# Altium schematic sheet TemperatureMon.SchDoc
size 431 x 279 mm; SheetNumber: 7; SheetTotal: 8
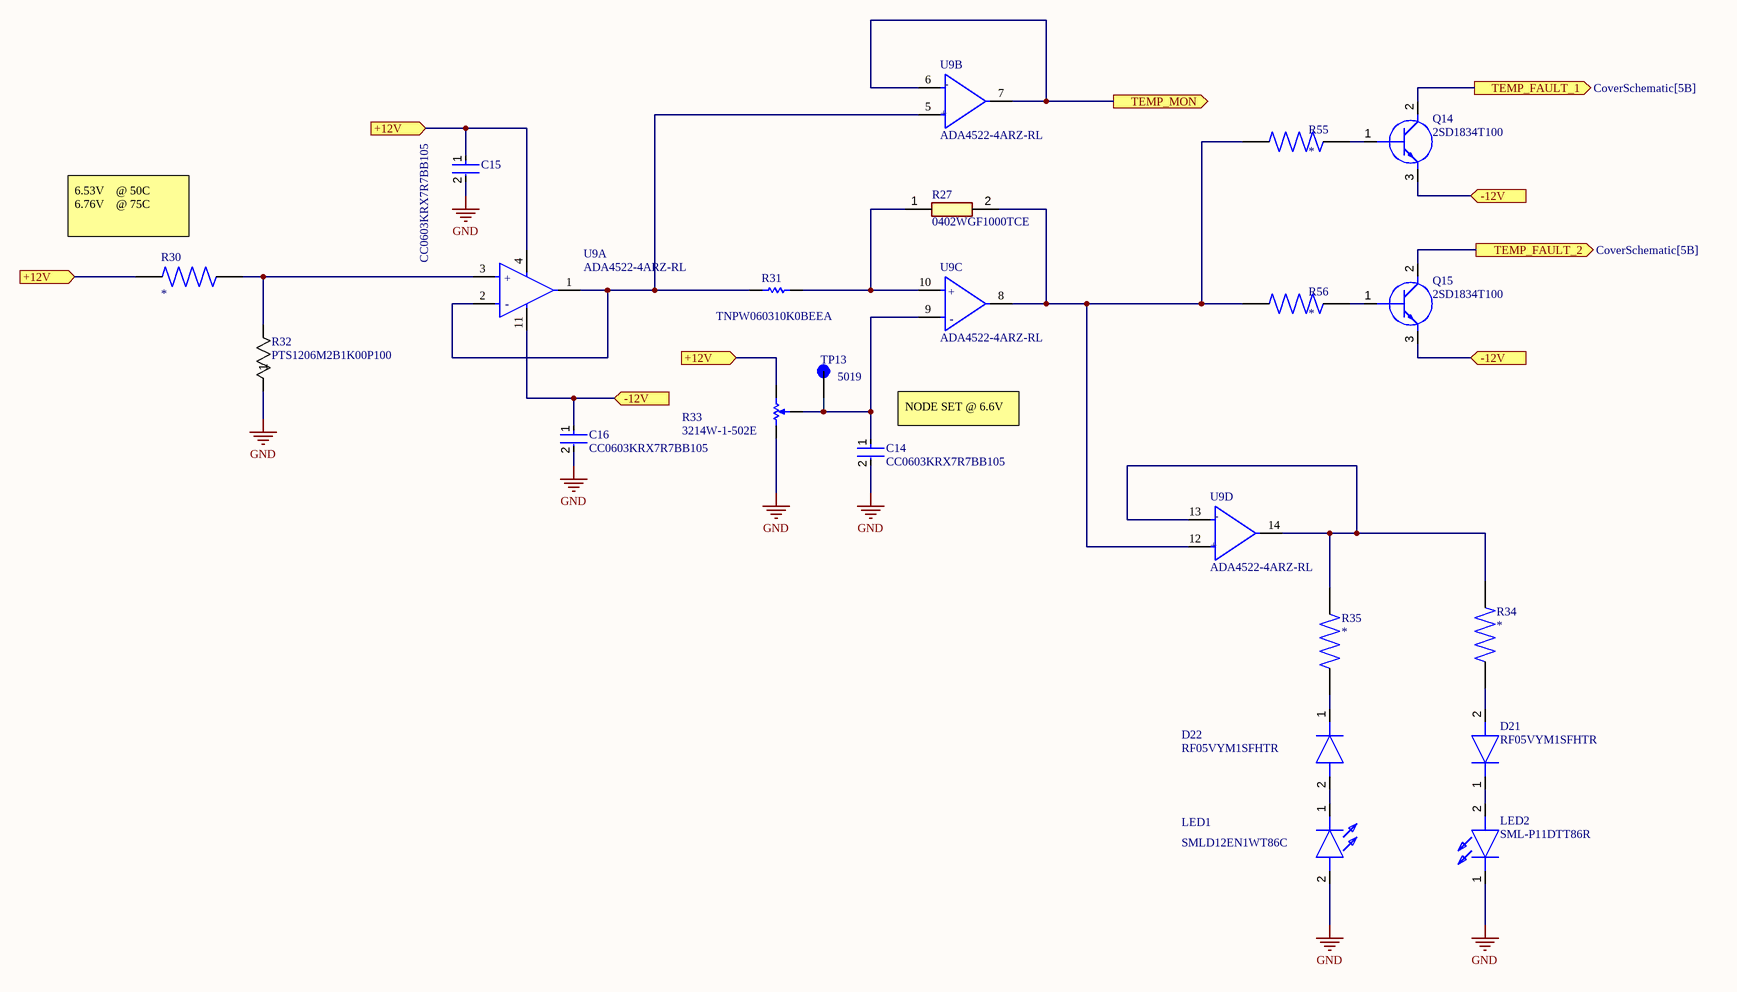
[diagram p0: TemperatureMon.SchDoc]

## Parts
C14  CC0603KRX7R7BB105  [FP-CC0603-DA-MFG]
C15  CC0603KRX7R7BB105  [FP-CC0603-DA-MFG]
C16  CC0603KRX7R7BB105  [FP-CC0603-DA-MFG]
D21  RF05VYM1SFHTR  [RF05VYM1SFHTR]
D22  RF05VYM1SFHTR  [RF05VYM1SFHTR]
LED1  SMLD12EN1WT86C  [SMLD12EN1WT86C]
LED2  SML-P11DTT86R  [SML-P11(1X0.6)]
Q14  2SD1834T100  [RJP020N06]
Q15  2SD1834T100  [RJP020N06]
R27  0402WGF1000TCE  [RESC1005X40N]
R30  MCT06030C1001FP500  [RESC1508X55N]  (value not drawn)
R31  TNPW060310K0BEEA  [RESC1609X55X30NL10T20]
R32  PTS1206M2B1K00P100  [PTS 1206_VIS]
R33  3214W-1-502E  [BOUR-3214W_V]
R34  MCT06030C1001FP500  [RESC1508X55N]  (value not drawn)
R35  MCT06030C1001FP500  [RESC1508X55N]  (value not drawn)
R55  MCT06030C1001FP500  [RESC1508X55N]  (value not drawn)
R56  MCT06030C1001FP500  [RESC1508X55N]  (value not drawn)
TP13  5019  [KEYSTONE_5019]
U9  ADA4522-4ARZ-RL  [FP-R-14-IPC_C]  (parts A,B,C,D of 4)

## Ports
+12V (in, see CoverSchematic[6B], Lownoise_auxReg[4D], Reference[9F], SolidStateDosimeter[5C]), -12V (in, see CoverSchematic[6B], Lownoise_auxReg[4C], PassElement[4C], PassElement[4E], PassElement[4F], SolidStateDosimeter[5B]), TEMP_FAULT_1 (out, see CoverSchematic[5B]), TEMP_FAULT_2 (out, see CoverSchematic[5B]), TEMP_MON (out, see CoverSchematic[5B], Connector[2D])

## Nets
GND: C14.2 C15.2 C16.2 LED1.2(A) LED2.1(K) R32.1 R33.1
+12V: C15.1 R30.2 R33.3 U9.4(V+) ; port +12V
-12V: C16.1 Q14.3(E) Q15.3(E) U9.11(V-) ; port -12V
TEMP_FAULT_1: Q14.2(C) ; port TEMP_FAULT_1
TEMP_FAULT_2: Q15.2(C) ; port TEMP_FAULT_2
TEMP_MON: U9.6(-IN_B) U9.7(OUT_B) ; port TEMP_MON
NetC14_1: C14.1 R33.2 TP13.TP U9.9(-IN_C)
NetD21_1: D21.1(K) LED2.2(A)
NetD21_2: D21.2(A) R34.2
NetD22_1: D22.1(K) R35.2
NetD22_2: D22.2(A) LED1.1(K)
NetQ14_1: Q14.1(B) R55.2
NetQ15_1: Q15.1(B) R56.2
NetR27_1: R27.1 R31.2 U9.10(+IN_C)
NetR27_2: R27.2 R55.1 R56.1 U9.8(OUT_C) U9.12(+IN_D)
NetR30_1: R30.1 R32.2 U9.3(+IN_A)
NetR31_1: R31.1 U9.1(OUT_A) U9.2(-IN_A) U9.5(+IN_B)
NetR34_1: R34.1 R35.1 U9.13(-IN_D) U9.14(OUT_D)

## Notes on the sheet
- (near R30) 6.53V    @ 50C
  6.76V    @ 75C
- (near C14) NODE SET @ 6.6V
- DWG. NO.
- REV.
- SHT.
- THIS DOCUMENT AND THE DATA DISCLOSED HEREIN OR HEREWITH IS THE PROPERTY OF ALTIUM LIMITED AND MAY BE FREELY DISTRIBUTED IN WHOLE. NO RIGHTS ARE RESERVED OR EXPRESS OR IMPLIED WARANTEE GIVEN.
- REVISION
- DESCRIPTION
- DATE
- APPROVED
- TITLE
- PROJECT
- SCALE:
- B
- SIZE
- CAGE CODE
- FILE NAME
- DWG by:
- Heitor Sampaio Mendes
- SHEET
- OF
- REV
- (in symbol CMP-09116-000280-1, part A) +; -
- (in symbol CMP-09116-000280-1, part B) -; +
- (in symbol CMP-09116-000280-1, part C) +; -
- (in symbol CMP-09116-000280-1, part D) -; +

## Library data of the parts
C14-C16 = CMP-03422-000924-1: CAP CER 1UF 16V X7R 0603; Manufacturer: YAGEO; Tolerance: 0.1; Temperature Coefficient: 15%; Material: Ceramic; Package: CC0603-DA; RoHS: TRUE; Device Class L2: Capacitors; Temperature Characteristic: X7R; Temperature: -55°C to +125°C; Temperature Range Low: -55°C; Automotive: No; ComponentLink2Description: Datasheet; Value: 1 uF; Lead Free: Yes; Capacitance: 1 uF; ComponentLink2URL: http://www.yageo.com/documents/recent/UPY-GPHC_X7R_6.3V-to-50V_18.pdf; Device Class L1: Passive Components; Voltage: 16 V; Octopart: https://octopart.com/cc0603krx7r7bb105-yageo-42271928; Category: Cap; Digikey Description: CAP CER 1UF 16V X7R 0603; Footprint Url: http://www.yageo.com/exep/pages/download/literatures/UPY-C_GEN_24.pdf; Height: 0.9mm; Manufacturer Part Number: CC0603KRX7R7BB105; Voltage Rating: 16 V; Temperature Range High: +125°C; Mouser Description: Multilayer Ceramic Capacitor, CC Series, 1 - F, - 10%, X7R, 16 V, 0603 [1608 Metric]; Device Class L3: Ceramic Capacitors
D21 D22 = RF05VYM1SFHTR: Diode; Manufacturer_Name: ROHM Semiconductor; Datasheet Link: https://fscdn.rohm.com/en/products/databook/datasheet/discrete/diode/fast_recovery/rf05vym1sfh.pdf; Height: 0.8mm; Manufacturer_Part_Number: RF05VYM1SFHTR; Mouser Part Number: 755-RF05VYM1SFHTR; Mouser Price/Stock: https://www.mouser.co.uk/ProductDetail/ROHM-Semiconductor/RF05VYM1SFHTR?qs=4v%252BiZTmLVHEBI5apodawUw%3D%3D
LED1 = SMLD12EN1WT86C: LED; Manufacturer_Name: ROHM Semiconductor; Datasheet Link: https://fscdn.rohm.com/en/products/databook/datasheet/opto/led/chip_mono/smld12en1wt86(c)-e.pdf; Height: 0.65mm; Manufacturer_Part_Number: SMLD12EN1WT86C; Mouser Part Number: 755-SMLD12EN1WT86C; Mouser Price/Stock: https://www.mouser.co.uk/ProductDetail/ROHM-Semiconductor/SMLD12EN1WT86C?qs=Z%252BL2brAPG1KJHKBIKSy7wg%3D%3D
LED2 = SML-P11DTT86R: LED; Manufacturer_Name: ROHM Semiconductor; Datasheet Link: https://componentsearchengine.com/Datasheets/2/SML-P11DTT86R.pdf; Manufacturer_Part_Number: SML-P11DTT86R; Mouser Part Number: 755-SML-P11DTT86R; Mouser Price/Stock: https://www.mouser.co.uk/ProductDetail/ROHM-Semiconductor/SML-P11DTT86R?qs=Ei%2Fnxee9QYgth7PNBqfe%252BA%3D%3D
Q14 Q15 = 2SD1834T100: Transistor BJT NPN; Manufacturer_Name: ROHM Semiconductor; Datasheet Link: https://fscdn.rohm.com/en/products/databook/datasheet/discrete/transistor/bipolar/2sd1834t100-e.pdf; Height: 1.45mm; Manufacturer_Part_Number: 2SD1834T100; Mouser Part Number: 755-2SD1834T100; Mouser Price/Stock: https://www.mouser.co.uk/ProductDetail/ROHM-Semiconductor/2SD1834T100?qs=4kLU8WoGk0vMh1jN%252BYQmXQ%3D%3D
R27 = 0402WGF1000TCE: Resistor; Manufacturer_Name: UNI-ROYAL(Uniroyal Elec); Datasheet Link: https://datasheet.lcsc.com/szlcsc/Uniroyal-Elec-0402WGF1000TCE_C25076.pdf; Height: 0.4mm; Manufacturer_Part_Number: 0402WGF1000TCE
R30 R34 R35 R55 R56 = MCT06030C1001FP500: Res Thin Film 0603 1K Ohm 1% 0.1W(1/10W) ?50ppm/C Molded SMD Automotive Medical T/R; MF: {'manufacturer': u'Vishay Beyschlag'}; Value: *; Package: None; Price: None; MP: MCT06030C1001FP500; Availability: Unavailable
R31 = CMP-2000-03691-1: Manufacturer: Vishay Dale; Part Number: TNPW060310K0BEEA
R32 = PTS1206M2B1K00P100: No Description Available; Mfr_Name: Vishay
R33 = CMP-2000-05579-1: 3214 - 5-Turn Trimpot(R) Trimming Potentiometer, 5 KOhm, +/- 10%, 0.25 W, -65 to 150 degC, RoHS, Tape and Reel; Manufacturer: Bourns; Temperature Coefficient: ±100ppm/°C; Power Rating: 250mW; No. of Turns: 5; Track Resistance: 5kohm; SVHC: NoSVHC(16-Jun-2014); Potentiometer Mounting: SMD; Manufacturer URL: http://www.bourns.com/; Resistance Tolerance: ±10%; Datasheet URL: http://www.bourns.com/docs/Product-Datasheets/3214.pdf; ROHS COMPLIANT: Yes; Mounting Technology: SurfaceMount; Datasheet Version: 05/2016; Package Reference: 3214W; Package Description: 3-Pin Surface Mount Device, Body 3.5 x 4.8 mm, Pitch 1.25 mm
TP13 = 5019: MF: {'manufacturer': u'Keystone Electronics'}; Package: None; Price: None; Value: *; MP: 5019; Availability: Unavailable
U9 = CMP-09116-000280-1: IC OPAMP ZERO-DRIFT 4CIRC 14SOIC; Min Supply Voltage: 4.5V; Operating Supply Current: 830uA; Input Bias Current: 50pA; Number of Circuits: 4; Common Mode Rejection Ratio: 140dB; Output Current per Channel: 32mA; Slew Rate: 1.7V/µs; Power Supply Rejection Ratio (PSRR): 150dB; Input Offset Voltage (Vos): 1.5uV; Min Dual Supply Voltage: 2.25V; Max Supply Voltage: 55V; Gain Bandwidth Product: 2.7MHz; Max Dual Supply Voltage: 27.5V; Voltage Gain: 137dB; Max Operating Temperature: 125°C; Number of Pins: 14; Case/Package: SOIC; RoHS Compliant: Yes; Packaging: Tape and Reel; Min Operating Temperature: -40°C; Contact Plating: Tin; Lead Free: Contains Lead; Mount: Surface Mount